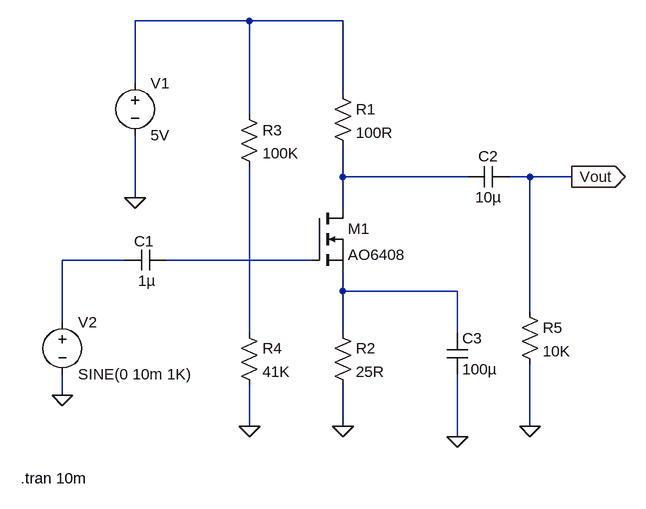
[diagram p0: schematic common source amplifier.asc]
common source amplifier.asc, the LTspice schematic file:
Version 4.1
SHEET 1 880 680
WIRE 112 -224 -64 -224
WIRE 256 -224 112 -224
WIRE -64 -128 -64 -224
WIRE 256 -112 256 -224
WIRE 112 -80 112 -224
WIRE 256 16 256 -32
WIRE 448 16 256 16
WIRE 544 16 512 16
WIRE 608 16 544 16
WIRE -64 48 -64 -48
WIRE 256 64 256 16
WIRE -80 144 -176 144
WIRE 208 144 -16 144
WIRE 256 192 256 160
WIRE 432 192 256 192
WIRE 544 224 544 16
WIRE -176 240 -176 144
WIRE 112 256 112 0
WIRE 256 256 256 192
WIRE 432 256 432 192
WIRE -176 352 -176 320
WIRE 112 400 112 336
WIRE 256 400 256 336
WIRE 544 400 544 304
WIRE 432 416 432 320
FLAG -64 48 0
FLAG 112 400 0
FLAG 544 400 0
FLAG 608 16 Vout
IOPIN 608 16 Out
FLAG 256 400 0
FLAG 432 416 0
FLAG -176 352 0
SYMBOL nmos 208 64 R0
SYMATTR InstName M1
SYMATTR Value AO6408
SYMBOL res 240 -128 R0
SYMATTR InstName R1
SYMATTR Value 100R
SYMBOL res 96 -96 R0
SYMATTR InstName R3
SYMATTR Value 100K
SYMBOL voltage -64 -144 R0
SYMATTR InstName V1
SYMATTR Value 5V
SYMBOL cap 512 0 R90
WINDOW 0 0 32 VBottom 2
WINDOW 3 32 32 VTop 2
SYMATTR InstName C2
SYMATTR Value 10µ
SYMATTR Description Capacitor
SYMATTR Type cap
SYMATTR SpiceLine V=16 Irms=44m Rser=2.4876 Lser=4.113n mfg="Würth Elektronik" pn="860010372001 WCAP-ATG8 5x11" type="Al electrolytic"
SYMBOL cap 416 256 R0
SYMATTR InstName C3
SYMATTR Value 100µ
SYMATTR SpiceLine V=6.3 Irms=10.4 Rser=0.00317263 Lser=0 mfg="KEMET" pn="C1210C107K9PAC" type="X5R"
SYMBOL res 96 240 R0
SYMATTR InstName R4
SYMATTR Value 41K
SYMBOL res 528 208 R0
SYMATTR InstName R5
SYMATTR Value 10K
SYMBOL res 240 240 R0
SYMATTR InstName R2
SYMATTR Value 25R
SYMBOL voltage -176 224 R0
WINDOW 123 0 0 Left 0
WINDOW 39 0 0 Left 0
SYMATTR InstName V2
SYMATTR Value SINE(0 10m 1K)
SYMBOL cap -16 128 R90
WINDOW 0 3 34 VBottom 2
WINDOW 3 32 30 VTop 2
SYMATTR InstName C1
SYMATTR Value 1µ
SYMATTR Description Capacitor
SYMATTR Type cap
SYMATTR SpiceLine V=16 Irms=0 Rser=11 Lser=0 mfg="AVX" pn="TAJA105K016" type="Tantalum"
TEXT -240 480 Left 2 !.tran 10m

The netlist it stands for:
* common source amplifier.asc
M1 N002 N004 N005 N005 AO6408
R1 N001 N002 100R
R3 N001 N006 100K
V1 N001 0 5V
C2 Vout N002 10µ V=16 Irms=44m Rser=2.4876 Lser=4.113n mfg="Würth Elektronik" pn="860010372001 WCAP-ATG8 5x11" type="Al electrolytic"
C3 N005 0 100µ V=6.3 Irms=10.4 Rser=0.00317263 Lser=0 mfg="KEMET" pn="C1210C107K9PAC" type="X5R"
R4 N006 0 41K
R5 Vout 0 10K
R2 N005 0 25R
V2 N003 0 SINE(0 10m 1K)
C1 N004 N003 1µ V=16 Irms=0 Rser=11 Lser=0 mfg="AVX" pn="TAJA105K016" type="Tantalum"
.model NMOS NMOS
.model PMOS PMOS
.lib standard.mos
.tran 10m
.backanno
.end